# Altium schematic sheet Due_Breakout_Board Headers.SchDoc: Due Breakout Board Headers
size A; Author: A. Jefferson; DocumentNumber: 2; Revision: A; SheetNumber: 2; SheetTotal: 3
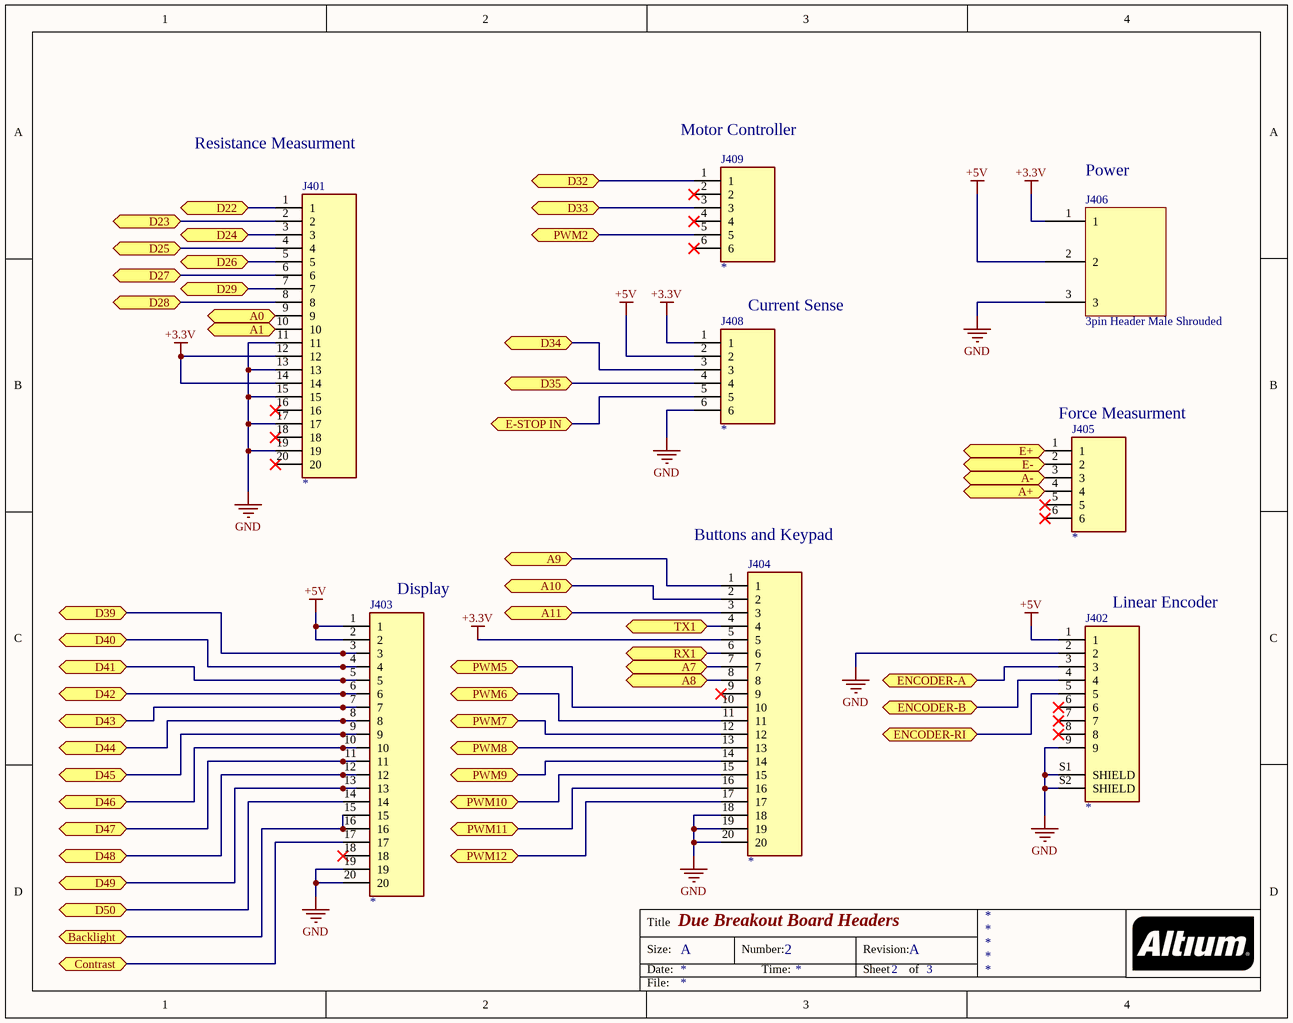
[diagram p0: Due_Breakout_Board Headers.SchDoc]

## Parts
J401  *  [TE_1761681-7]
J402  1-5747150-6  [TE_1-5747150-6]  (value not drawn)
J403  *  [TE_1761681-7]
J404  *  [TE_1761681-7]
J405  *  [TE_1761681-1]
J406  3pin Header Male Shrouded  [3Pin Header]
J408  *  [TE_1761681-1]
J409  *  [TE_1761681-1]

## Ports
A0, A1, A7, A8, A9, A10, A11, A+, A-, Backlight, Contrast, D22, D23, D24, D25, D26, D27, D28, D29, D32, D33, D34, D35, D39, D40, D41, D42, D43, D44, D45, D46, D47, D48, D49, D50, E+, E-, E-STOP IN, ENCODER-A, ENCODER-B, ENCODER-RI, PWM2, PWM5, PWM6, PWM7, PWM8, PWM9, PWM10, PWM11, PWM12, RX1, TX1

## Nets
+3.3V: J401.12 J401.14 J404.5 J406.1 J408.1
+5V: J402.1 J403.1 J403.2 J406.2 J408.2
GND: J401.11 J401.13 J401.15 J401.17 J401.19 J402.2 J402.9 J402.S1(SHIELD) J402.S2(SHIELD) J403.19 J403.20 J404.18 J404.19 J404.20 J406.3 J408.6
A0: J401.9 ; port A0
A1: J401.10 ; port A1
A7: J404.7 ; port A7
A8: J404.8 ; port A8
A9: J404.1 ; port A9
A10: J404.2 ; port A10
A11: J404.3 ; port A11
A+: J405.4 ; port A+
A-: J405.3 ; port A-
Backlight: J403.15 J403.16 ; port Backlight
Contrast: J403.17 ; port Contrast
D22: J401.1 ; port D22
D23: J401.2 ; port D23
D24: J401.3 ; port D24
D25: J401.4 ; port D25
D26: J401.5 ; port D26
D27: J401.6 ; port D27
D28: J401.8 ; port D28
D29: J401.7 ; port D29
D32: J409.1 ; port D32
D33: J409.3 ; port D33
D34: J408.3 ; port D34
D35: J408.4 ; port D35
D39: J403.3 ; port D39
D40: J403.4 ; port D40
D41: J403.5 ; port D41
D42: J403.6 ; port D42
D43: J403.7 ; port D43
D44: J403.8 ; port D44
D45: J403.9 ; port D45
D46: J403.10 ; port D46
D47: J403.11 ; port D47
D48: J403.12 ; port D48
D49: J403.13 ; port D49
D50: J403.14 ; port D50
E+: J405.1 ; port E+
E-: J405.2 ; port E-
E-STOP IN: J408.5 ; port E-STOP IN
ENCODER-A: J402.3 ; port ENCODER-A
ENCODER-B: J402.4 ; port ENCODER-B
ENCODER-RI: J402.5 ; port ENCODER-RI
PWM2: J409.5 ; port PWM2
PWM5: J404.10 ; port PWM5
PWM6: J404.11 ; port PWM6
PWM7: J404.12 ; port PWM7
PWM8: J404.13 ; port PWM8
PWM9: J404.14 ; port PWM9
PWM10: J404.15 ; port PWM10
PWM11: J404.16 ; port PWM11
PWM12: J404.17 ; port PWM12
RX1: J404.6 ; port RX1
TX1: J404.4 ; port TX1

Not connected (* = marked no-connect by the designer): J401 16* 18* 20*; J402 6* 7* 8*; J403 18*; J404 9*; J405 5* 6*; J409 2* 4* 6*

## Notes on the sheet
- Resistance Measurment
- (near J409) Motor Controller
- (near J406) Power
- Current Sense
- (near J405) Force Measurment
- (near J404) Buttons and Keypad
- (near J403) Display
- (near J402) Linear Encoder
- Title
- Size:
- Date:
- A
- Number:
- Time:
- Revision:
- Sheet
- of
- File:

## Library data of the parts
J401 J403 J404 = 1761681-7: IDC LOW PRO HDR 50P VERT HT BLACK; Package: None; Price: None; Value: *; MP: 1761681-7; Availability: Unavailable
J402 = 1-5747150-6: 9 Position D-Sub Receptacle, Female Sockets Connector; MF: TE Connectivity; Centerline_Pitch: 2.74 mm[.108 in]; Number_of_Positions: 9; Package: None; Price: None; MP: 1-5747150-6; TE_purchase_URL: https://www.te.com/usa-en/product-1-5747150-6.html?te_bu=Cor&te_type=disp&te_campaign=seda_glo_cor-seda-global-disp-prtnr-fy19-seda-model-bom-cta_sma-317_1&elqCampaignId=32493; Availability: Unavailable; Value: *; SnapEDA_Link: https://www.snapeda.com/parts/1-5747150-6/TE%20Connectivity%20AMP%20Connectors/view-part/2374527/?ref=snap; Product_Type: Connector; Comment_1: *
J405 J408 J409 = 1761681-1: MF: {'manufacturer': 'TE Connectivity'}; Package: None; MP: 1761681-1; Price: None; Value: *; Availability: Unavailable